# EAGLE design practice-board (EAGLE 7.3.0)
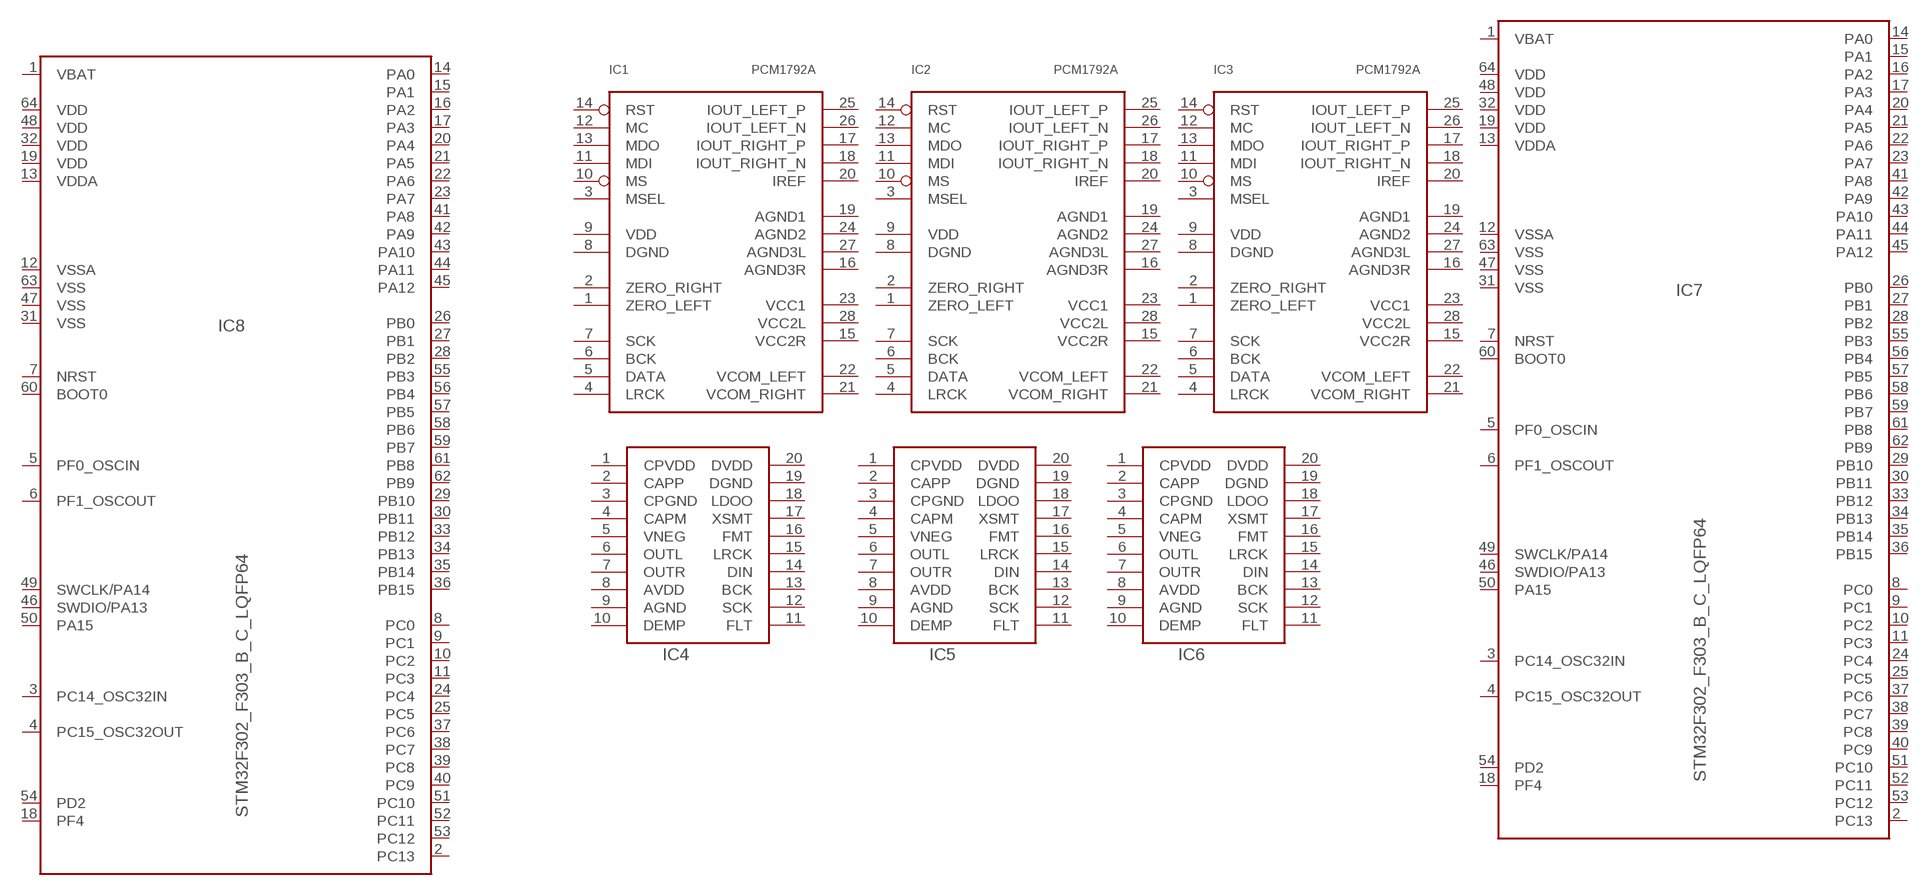
[diagram p0: schematic, sheet 1]

## Parts
IC1  PCM1792A  [SSOP28]
IC2  PCM1792A  [SSOP28]
IC3  PCM1792A  [SSOP28]
IC4  PCM5102  [TSSOP20]
IC5  PCM5102  [TSSOP20]
IC6  PCM5102  [TSSOP20]
IC7  STM32F302_F303_B_C_LQFP64  [TQFP64]
IC8  STM32F302_F303_B_C_LQFP64  [TQFP64]
Unconnected: IC1.1(ZERO_LEFT) IC1.2(ZERO_RIGHT) IC1.3(MSEL) IC1.4(LRCK) IC1.5(DATA) IC1.6(BCK) IC1.7(SCK) IC1.8(DGND) IC1.9(VDD) IC1.10(MS) IC1.11(MDI) IC1.12(MC) IC1.13(MDO) IC1.14(RST) IC1.15(VCC2R) IC1.16(AGND3R) IC1.17(IOUT_RIGHT_P) IC1.18(IOUT_RIGHT_N) IC1.19(AGND1) IC1.20(IREF) IC1.21(VCOM_RIGHT) IC1.22(VCOM_LEFT) IC1.23(VCC1) IC1.24(AGND2) IC1.25(IOUT_LEFT_P) IC1.26(IOUT_LEFT_N) IC1.27(AGND3L) IC1.28(VCC2L) IC2.1(ZERO_LEFT) IC2.2(ZERO_RIGHT) IC2.3(MSEL) IC2.4(LRCK) IC2.5(DATA) IC2.6(BCK) IC2.7(SCK) IC2.8(DGND) IC2.9(VDD) IC2.10(MS) IC2.11(MDI) IC2.12(MC) IC2.13(MDO) IC2.14(RST) IC2.15(VCC2R) IC2.16(AGND3R) IC2.17(IOUT_RIGHT_P) IC2.18(IOUT_RIGHT_N) IC2.19(AGND1) IC2.20(IREF) IC2.21(VCOM_RIGHT) IC2.22(VCOM_LEFT) IC2.23(VCC1) IC2.24(AGND2) IC2.25(IOUT_LEFT_P) IC2.26(IOUT_LEFT_N) IC2.27(AGND3L) IC2.28(VCC2L) IC3.1(ZERO_LEFT) IC3.2(ZERO_RIGHT) IC3.3(MSEL) IC3.4(LRCK) IC3.5(DATA) IC3.6(BCK) IC3.7(SCK) IC3.8(DGND) IC3.9(VDD) IC3.10(MS) IC3.11(MDI) IC3.12(MC) IC3.13(MDO) IC3.14(RST) IC3.15(VCC2R) IC3.16(AGND3R) IC3.17(IOUT_RIGHT_P) IC3.18(IOUT_RIGHT_N) IC3.19(AGND1) IC3.20(IREF) IC3.21(VCOM_RIGHT) IC3.22(VCOM_LEFT) IC3.23(VCC1) IC3.24(AGND2) IC3.25(IOUT_LEFT_P) IC3.26(IOUT_LEFT_N) IC3.27(AGND3L) IC3.28(VCC2L) IC4.1(CPVDD) IC4.2(CAPP) IC4.3(CPGND) IC4.4(CAPM) IC4.5(VNEG) IC4.6(OUTL) IC4.7(OUTR) IC4.8(AVDD) IC4.9(AGND) IC4.10(DEMP) IC4.11(FLT) IC4.12(SCK) IC4.13(BCK) IC4.14(DIN) IC4.15(LRCK) IC4.16(FMT) IC4.17(XSMT) IC4.18(LDOO) IC4.19(DGND) IC4.20(DVDD) IC5.1(CPVDD) IC5.2(CAPP) IC5.3(CPGND) IC5.4(CAPM) IC5.5(VNEG) IC5.6(OUTL) IC5.7(OUTR) IC5.8(AVDD) IC5.9(AGND) IC5.10(DEMP) IC5.11(FLT) IC5.12(SCK) IC5.13(BCK) IC5.14(DIN) IC5.15(LRCK) IC5.16(FMT) IC5.17(XSMT) IC5.18(LDOO) IC5.19(DGND) IC5.20(DVDD) IC6.1(CPVDD) IC6.2(CAPP) IC6.3(CPGND) IC6.4(CAPM) IC6.5(VNEG) IC6.6(OUTL) IC6.7(OUTR) IC6.8(AVDD) IC6.9(AGND) IC6.10(DEMP) IC6.11(FLT) IC6.12(SCK) IC6.13(BCK) IC6.14(DIN) IC6.15(LRCK) IC6.16(FMT) IC6.17(XSMT) IC6.18(LDOO) IC6.19(DGND) IC6.20(DVDD) IC7.1(VBAT) IC7.2(PC13) IC7.3(PC14_OSC32IN) IC7.4(PC15_OSC32OUT) IC7.5(PF0_OSCIN) IC7.6(PF1_OSCOUT) IC7.7(NRST) IC7.8(PC0) IC7.9(PC1) IC7.10(PC2) IC7.11(PC3) IC7.14(PA0) IC7.15(PA1) IC7.16(PA2) IC7.17(PA3) IC7.18(PF4) IC7.20(PA4) IC7.21(PA5) IC7.22(PA6) IC7.23(PA7) IC7.24(PC4) IC7.25(PC5) IC7.26(PB0) IC7.27(PB1) IC7.28(PB2) IC7.29(PB10) IC7.30(PB11) IC7.33(PB12) IC7.34(PB13) IC7.35(PB14) IC7.36(PB15) IC7.37(PC6) IC7.38(PC7) IC7.39(PC8) IC7.40(PC9) IC7.41(PA8) IC7.42(PA9) IC7.43(PA10) IC7.44(PA11) IC7.45(PA12) IC7.46(SWDIO/PA13) IC7.49(SWCLK/PA14) IC7.50(PA15) IC7.51(PC10) IC7.52(PC11) IC7.53(PC12) IC7.54(PD2) IC7.55(PB3) IC7.56(PB4) IC7.57(PB5) IC7.58(PB6) IC7.59(PB7) IC7.60(BOOT0) IC7.61(PB8) IC7.62(PB9) IC8.1(VBAT) IC8.2(PC13) IC8.3(PC14_OSC32IN) IC8.4(PC15_OSC32OUT) IC8.5(PF0_OSCIN) IC8.6(PF1_OSCOUT) IC8.7(NRST) IC8.8(PC0) IC8.9(PC1) IC8.10(PC2) IC8.11(PC3) IC8.14(PA0) IC8.15(PA1) IC8.16(PA2) IC8.17(PA3) IC8.18(PF4) IC8.20(PA4) IC8.21(PA5) IC8.22(PA6) IC8.23(PA7) IC8.24(PC4) IC8.25(PC5) IC8.26(PB0) IC8.27(PB1) IC8.28(PB2) IC8.29(PB10) IC8.30(PB11) IC8.33(PB12) IC8.34(PB13) IC8.35(PB14) IC8.36(PB15) IC8.37(PC6) IC8.38(PC7) IC8.39(PC8) IC8.40(PC9) IC8.41(PA8) IC8.42(PA9) IC8.43(PA10) IC8.44(PA11) IC8.45(PA12) IC8.46(SWDIO/PA13) IC8.49(SWCLK/PA14) IC8.50(PA15) IC8.51(PC10) IC8.52(PC11) IC8.53(PC12) IC8.54(PD2) IC8.55(PB3) IC8.56(PB4) IC8.57(PB5) IC8.58(PB6) IC8.59(PB7) IC8.60(BOOT0) IC8.61(PB8) IC8.62(PB9)

## Power pins joined to a net without a drawn wire
VDD: IC7.19(VDD) IC7.32(VDD) IC7.48(VDD) IC7.64(VDD) IC8.19(VDD) IC8.32(VDD) IC8.48(VDD) IC8.64(VDD)
VDDA: IC7.13(VDDA) IC8.13(VDDA)
VSS: IC7.31(VSS) IC7.47(VSS) IC7.63(VSS) IC8.31(VSS) IC8.47(VSS) IC8.63(VSS)
VSSA: IC7.12(VSSA) IC8.12(VSSA)

## Library data of the parts
IC1-IC3 = keves:PCM1792A
IC4-IC6 = PCM5102:PCM5102
IC7 IC8 = keves:STM32F302_F303_B_C_LQFP64: STM32F302_F303_B_C_LQFP64 edit this description Auto generated by make-symbol-device-package-bsdl.ulp Rev. 44 Source: STM32F302_F303_B_C_LQFP64.bsd

## Board
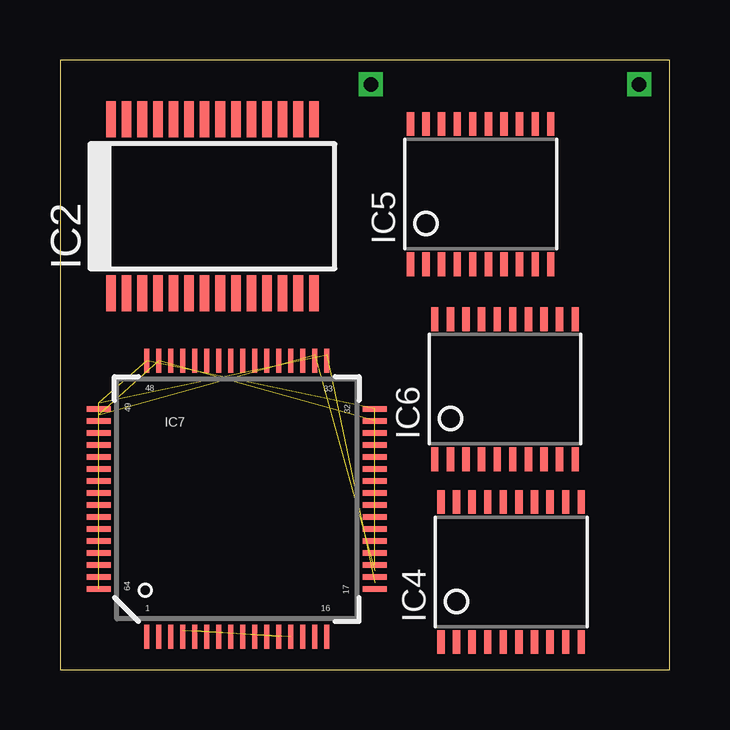
[diagram p1: board, top side]
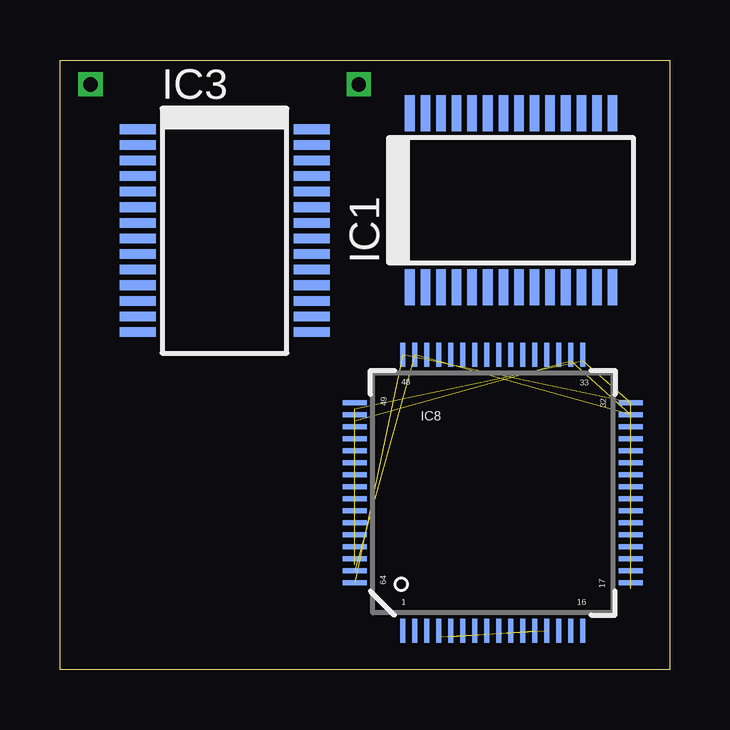
[diagram p2: board, bottom side, seen from below]

Size 25.4 x 25.4 mm. Coordinates in mm from the lower left corner, seen from the top.
Outline: 0,0 25.4,0 25.4,25.4 0,25.4 0,0
Copper layers (1*16): Top 0.035mm / dielectric 1.5mm / Bottom 0.035mm
Design rules "default": minimum track width 10mil, minimum drill 24mil, track to track 8mil, track to pad 8mil, pad to pad 8mil, via to via 8mil, smd to smd 8mil, copper to edge 40mil, drill to drill 8mil, minimum pad ring 10mil, minimum via ring 8mil, stop-mask expansion 4mil, vias tented up to drill 0mil, thermal gap 10mil

### Footprints (pad centres in the part's own frame; a part is rotated, then mirrored left to right if it is on the bottom)
SSOP28 = smd 0.4 x 1.5: 1 -4.225,-3.625; 2 -3.575,-3.625; 3 -2.925,-3.625; 4 -2.275,-3.625; 5 -1.625,-3.625; 6 -0.975,-3.625; 7 -0.325,-3.625; 8 0.325,-3.625; 9 0.975,-3.625; 10 1.625,-3.625; 11 2.275,-3.625; 12 2.925,-3.625; 13 3.575,-3.625; 14 4.225,-3.625; 15 4.225,3.625; 16 3.575,3.625; 17 2.925,3.625; 18 2.275,3.625; 19 1.625,3.625; 20 0.975,3.625; 21 0.325,3.625; 22 -0.325,3.625; 23 -0.975,3.625; 24 -1.625,3.625; 25 -2.275,3.625; 26 -2.925,3.625; 27 -3.575,3.625; 28 -4.225,3.625
TSSOP20 = smd 0.305 x 0.991: 1 -2.925,-2.918; 2 -2.275,-2.918; 3 -1.625,-2.918; 4 -0.975,-2.918; 5 -0.325,-2.918; 6 0.325,-2.918; 7 0.975,-2.918; 8 1.625,-2.918; 9 2.275,-2.918; 10 2.925,-2.918; 11 2.925,2.918; 12 2.275,2.918; 13 1.625,2.918; 14 0.975,2.918; 15 0.325,2.918; 16 -0.325,2.918; 17 -0.975,2.918; 18 -1.625,2.918; 19 -2.275,2.918; 20 -2.925,2.918
TQFP64 = smd 0.22 x 1: 1 -3.75,-5.75; 2 -3.25,-5.75; 3 -2.75,-5.75; 4 -2.25,-5.75; 5 -1.75,-5.75; 6 -1.25,-5.75; 7 -0.75,-5.75; 8 -0.25,-5.75; 9 0.25,-5.75; 10 0.75,-5.75; 11 1.25,-5.75; 12 1.75,-5.75; 13 2.25,-5.75; 14 2.75,-5.75; 15 3.25,-5.75; 16 3.75,-5.75; 33 3.75,5.75; 34 3.25,5.75; 35 2.75,5.75; 36 2.25,5.75; 37 1.75,5.75; 38 1.25,5.75; 39 0.75,5.75; 40 0.25,5.75; 41 -0.25,5.75; 42 -0.75,5.75; 43 -1.25,5.75; 44 -1.75,5.75; 45 -2.25,5.75; 46 -2.75,5.75; 47 -3.25,5.75; 48 -3.75,5.75 | smd 1 x 0.22: 17 5.75,-3.75; 18 5.75,-3.25; 19 5.75,-2.75; 20 5.75,-2.25; 21 5.75,-1.75; 22 5.75,-1.25; 23 5.75,-0.75; 24 5.75,-0.25; 25 5.75,0.25; 26 5.75,0.75; 27 5.75,1.25; 28 5.75,1.75; 29 5.75,2.25; 30 5.75,2.75; 31 5.75,3.25; 32 5.75,3.75; 49 -5.75,3.75; 50 -5.75,3.25; 51 -5.75,2.75; 52 -5.75,2.25; 53 -5.75,1.75; 54 -5.75,1.25; 55 -5.75,0.75; 56 -5.75,0.25; 57 -5.75,-0.25; 58 -5.75,-0.75; 59 -5.75,-1.25; 60 -5.75,-1.75; 61 -5.75,-2.25; 62 -5.75,-2.75; 63 -5.75,-3.25; 64 -5.75,-3.75

### Placement (x,y rotation side)
IC1  6.6,19.56 0 bottom
IC2  6.35,19.3 0 top
IC3  18.54,18.29 270 bottom
IC4  18.8,4.06 0 top
IC5  17.53,19.81 0 top
IC6  18.54,11.68 0 top
IC7  7.37,7.11 0 top
IC8  7.37,7.37 0 bottom

### Tracks (layer width: path | path; a pad name or v marks a point on that pad's centre or on a via)
N$1  (via drill 0.6)
  other vias: 12.95,24.38
N$2  (via drill 0.6)
  other vias: 24.13,24.38
VDD  (7 unrouted)
VDDA  (1 unrouted)
VSS  (5 unrouted)
VSSA  (1 unrouted)